# Altium project ZYNQ7020.PrjPcb (part 3 of 3)
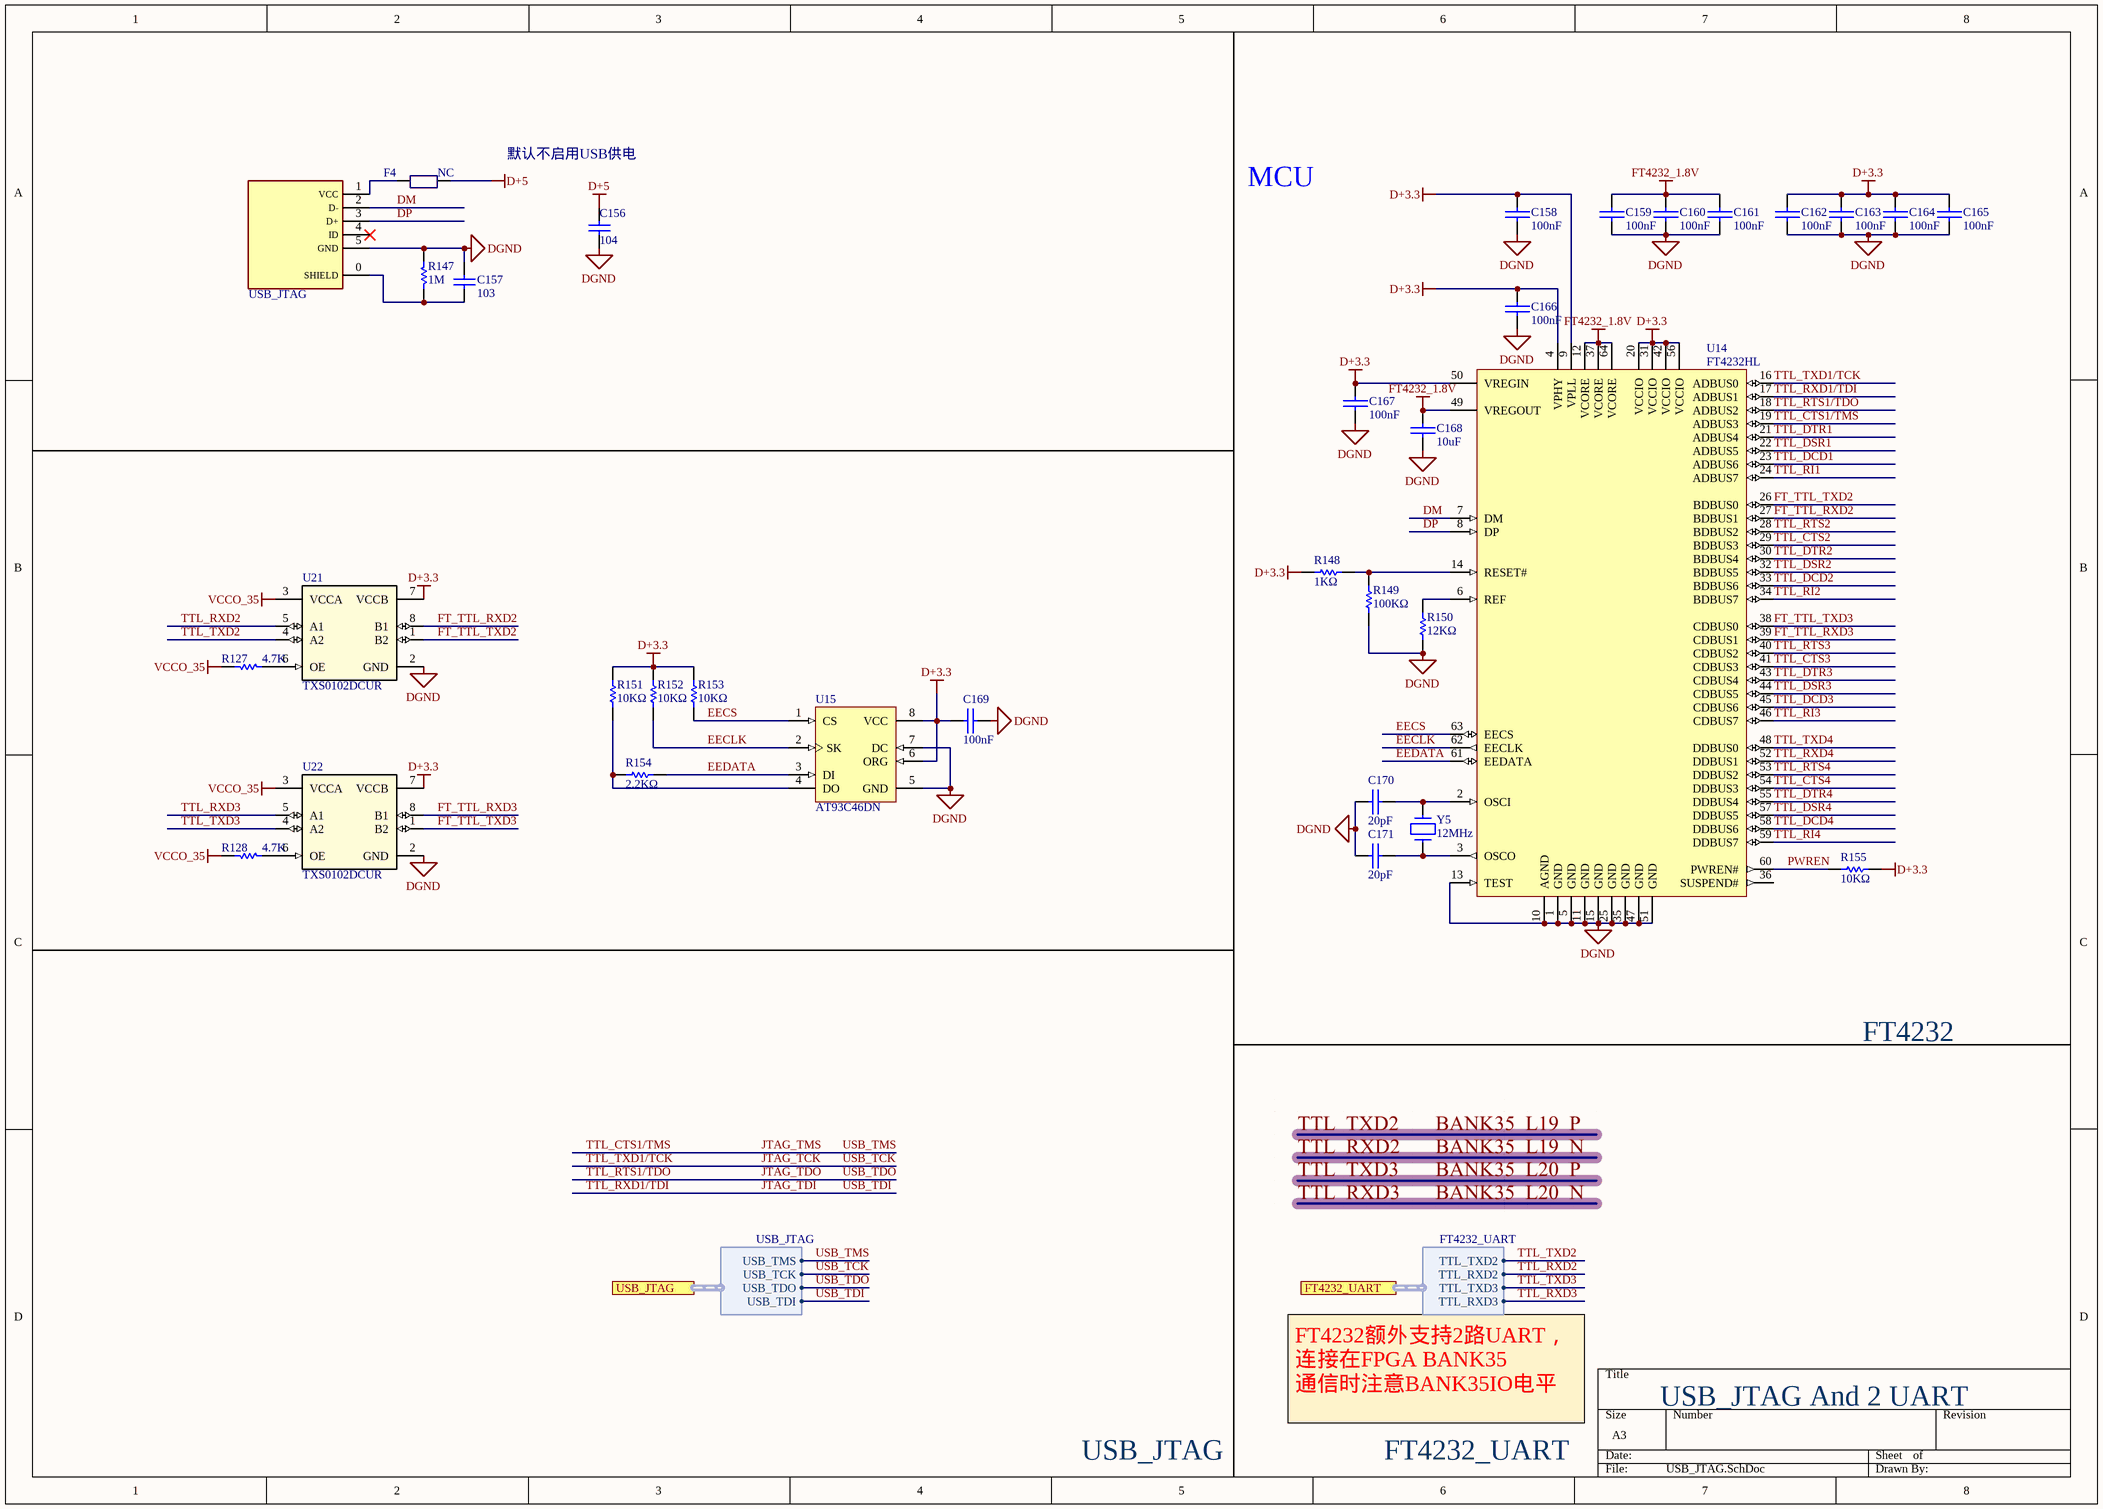
[diagram p16: USB_JTAG.SchDoc]

## Nets that join several sheets
D+1.0: ZYNQ_SOC_PWR (27 pins), PWR (R117.2), Ethernet (8 pins)
D+1.5: ZYNQ_SOC_ARM (R11.2 R13.2), ZYNQ_SOC_PWR (17 pins), DDR (70 pins), PWR (R37.1 R119.2 U18.2)
D+1.8: ZYNQ_SOC_PWR (FB2.1), PWR (R118.2), Ethernet (10 pins), USB (9 pins)
D+1.8_AUX: ZYNQ_SOC_ARM (R7.2 R8.2), ZYNQ_SOC_PWR (29 pins), UART (C195.2 R126.2 U20.3), SD_Card (C95.1 R124.1 U19.5)
D+3.3: ZYNQ_SOC_ARM (7 pins), ZYNQ_SOC_FPGA (C5.1 Y2.1 Y2.4), ZYNQ_SOC_JTAG (8 pins), ZYNQ_SOC_PWR (FB3.1), EX_IO (6 pins), FLASH (C46.2 R89.2 U5.8), Human_Interface (12 pins), UART (U20.7), SD_Card (5 pins), PWR (5 pins), Ethernet (14 pins), USB (5 pins), USB_JTAG (24 pins)
D+3.3_PS: ZYNQ_SOC_FPGA (R14.2), ZYNQ_SOC_JTAG (R17.2 R23.2 R24.2 U2.M6), ZYNQ_SOC_PWR (24 pins)
D+5: EX_IO (C44.1 C45.1 R157.2 R158.2), UART (R130.2), PWR (R122.2 R156.2), USB (FB4.1), USB_JTAG (C156.2 F4.1)
DDR_RVTT: DDR (41 pins), PWR (U18.3 U18.5)
DGND: ZYNQ_SOC_ARM (12 pins), ZYNQ_SOC_FPGA (C5.2 R15.1 Y2.2), ZYNQ_SOC_JTAG (19 pins), ZYNQ_SOC_PWR (102 pins), EX_IO (10 pins), FLASH (C46.1 U5.4), DDR (96 pins), Human_Interface (12 pins), UART (9 pins), SD_Card (9 pins), PWR (69 pins), Ethernet (35 pins), USB (28 pins), USB_JTAG (34 pins)
VCCO_35: ZYNQ_SOC_PWR (10 pins), USB_JTAG (R127.2 R128.2 U21.3 U22.3)
VTT_REF: DDR (U3.H1 U3.M8 U17.H1 U17.M8), PWR (C7.2 C190.2 U18.6)
BANK34_0: ZYNQ_SOC_FPGA (U2.R19), Human_Interface (R98.1)
BANK34_25: ZYNQ_SOC_FPGA (U2.T19), Human_Interface (R96.1)
BANK34_L1_N: ZYNQ_SOC_FPGA (U2.T10), EX_IO (RP18.2)
BANK34_L1_P: ZYNQ_SOC_FPGA (U2.T11), EX_IO (RP18.1)
BANK34_L2_N: ZYNQ_SOC_FPGA (U2.U12), EX_IO (RP16.3)
BANK34_L2_P: ZYNQ_SOC_FPGA (U2.T12), EX_IO (RP16.4)
BANK34_L4_N: ZYNQ_SOC_FPGA (U2.W13), EX_IO (RP14.3)
BANK34_L4_P: ZYNQ_SOC_FPGA (U2.V12), EX_IO (RP14.4)
BANK34_L5_N: ZYNQ_SOC_FPGA (U2.T15), EX_IO (RP14.1)
BANK34_L5_P: ZYNQ_SOC_FPGA (U2.T14), EX_IO (RP14.2)
BANK34_L6_N: ZYNQ_SOC_FPGA (U2.R14), EX_IO (RP12.2)
BANK34_L6_P: ZYNQ_SOC_FPGA (U2.P14), EX_IO (RP12.1)
BANK34_L7_N: ZYNQ_SOC_FPGA (U2.Y17), EX_IO (RP8.1)
BANK34_L7_P: ZYNQ_SOC_FPGA (U2.Y16), EX_IO (RP8.2)
BANK34_L8_N: ZYNQ_SOC_FPGA (U2.Y14), EX_IO (RP10.3)
BANK34_L8_P: ZYNQ_SOC_FPGA (U2.W14), EX_IO (RP10.4)
BANK34_L9_N: ZYNQ_SOC_FPGA (U2.U17), EX_IO (RP6.3)
BANK34_L9_P: ZYNQ_SOC_FPGA (U2.T16), EX_IO (RP6.4)
BANK34_L10_N: ZYNQ_SOC_FPGA (U2.W15), EX_IO (RP10.2)
BANK34_L10_P: ZYNQ_SOC_FPGA (U2.V15), EX_IO (RP10.1)
BANK34_L11_N: ZYNQ_SOC_FPGA (U2.U15), EX_IO (RP12.3)
BANK34_L11_P: ZYNQ_SOC_FPGA (U2.U14), EX_IO (RP12.4)
BANK34_L12_N: ZYNQ_SOC_FPGA (U2.U19), Human_Interface (R94.1)
BANK34_L13_N: ZYNQ_SOC_FPGA (U2.P19), EX_IO (RP2.4)
BANK34_L13_P: ZYNQ_SOC_FPGA (U2.N18), EX_IO (RP2.3)
BANK34_L14_N: ZYNQ_SOC_FPGA (U2.P20), EX_IO (RP2.2)
BANK34_L14_P: ZYNQ_SOC_FPGA (U2.N20), EX_IO (RP2.1)
BANK34_L15_N: ZYNQ_SOC_FPGA (U2.U20), EX_IO (RP4.2)
BANK34_L15_P: ZYNQ_SOC_FPGA (U2.T20), EX_IO (RP4.1)
BANK34_L16_N: ZYNQ_SOC_FPGA (U2.W20), EX_IO (RP4.4)
BANK34_L16_P: ZYNQ_SOC_FPGA (U2.V20), EX_IO (RP4.3)
BANK34_L17_N: ZYNQ_SOC_FPGA (U2.Y19), EX_IO (RP6.1)
BANK34_L17_P: ZYNQ_SOC_FPGA (U2.Y18), EX_IO (RP6.2)
BANK34_L18_N: ZYNQ_SOC_FPGA (U2.W16), EX_IO (RP8.4)
BANK34_L18_P: ZYNQ_SOC_FPGA (U2.V16), EX_IO (RP8.3)
BANK34_L21_N: ZYNQ_SOC_FPGA (U2.V18), Human_Interface (C50.2 PL_K2.1 R97.1)
BANK34_L21_P: ZYNQ_SOC_FPGA (U2.V17), Human_Interface (C49.2 PL_K1.1 R95.1)
BANK34_L22_N: ZYNQ_SOC_FPGA (U2.W19), Human_Interface (C52.2 PL_K4.1 R101.1)
BANK34_L22_P: ZYNQ_SOC_FPGA (U2.W18), Human_Interface (C51.2 PL_K3.1 R99.1)
BANK34_L23_N: ZYNQ_SOC_FPGA (U2.P18), Human_Interface (R100.1)
BANK34_L24_N: ZYNQ_SOC_FPGA (U2.P16), EX_IO (RP16.2)
BANK34_L24_P: ZYNQ_SOC_FPGA (U2.P15), EX_IO (RP16.1)
BANK35_L1_N: ZYNQ_SOC_FPGA (U2.B20), EX_IO (RP3.3)
BANK35_L1_P: ZYNQ_SOC_FPGA (U2.C20), EX_IO (RP3.4)
BANK35_L2_N: ZYNQ_SOC_FPGA (U2.A20), EX_IO (RP3.1)
BANK35_L2_P: ZYNQ_SOC_FPGA (U2.B19), EX_IO (RP3.2)
BANK35_L3_N: ZYNQ_SOC_FPGA (U2.D18), EX_IO (RP7.1)
BANK35_L3_P: ZYNQ_SOC_FPGA (U2.E17), EX_IO (RP7.2)
BANK35_L4_N: ZYNQ_SOC_FPGA (U2.D20), EX_IO (RP5.2)
BANK35_L4_P: ZYNQ_SOC_FPGA (U2.D19), EX_IO (RP5.1)
BANK35_L5_N: ZYNQ_SOC_FPGA (U2.E19), EX_IO (RP5.4)
BANK35_L5_P: ZYNQ_SOC_FPGA (U2.E18), EX_IO (RP5.3)
BANK35_L6_N: ZYNQ_SOC_FPGA (U2.F17), EX_IO (RP7.3)
BANK35_L6_P: ZYNQ_SOC_FPGA (U2.F16), EX_IO (RP7.4)
BANK35_L7_N: ZYNQ_SOC_FPGA (U2.M20), EX_IO (RP17.3)
BANK35_L7_P: ZYNQ_SOC_FPGA (U2.M19), EX_IO (RP17.4)
BANK35_L8_N: ZYNQ_SOC_FPGA (U2.M18), EX_IO (RP19.1)
BANK35_L8_P: ZYNQ_SOC_FPGA (U2.M17), EX_IO (RP19.2)
BANK35_L9_N: ZYNQ_SOC_FPGA (U2.L20), EX_IO (RP15.3)
BANK35_L9_P: ZYNQ_SOC_FPGA (U2.L19), EX_IO (RP15.4)
BANK35_L10_N: ZYNQ_SOC_FPGA (U2.J19), EX_IO (RP13.3)
BANK35_L10_P: ZYNQ_SOC_FPGA (U2.K19), EX_IO (RP13.4)
BANK35_L11_N: ZYNQ_SOC_FPGA (U2.L17), EX_IO (RP17.1)
BANK35_L11_P: ZYNQ_SOC_FPGA (U2.L16), EX_IO (RP17.2)
BANK35_L12_N: ZYNQ_SOC_FPGA (U2.K18), EX_IO (RP15.2)
BANK35_L12_P: ZYNQ_SOC_FPGA (U2.K17), EX_IO (RP15.1)
BANK35_L13_N: ZYNQ_SOC_FPGA (U2.H17), EX_IO (RP11.2)
BANK35_L13_P: ZYNQ_SOC_FPGA (U2.H16), EX_IO (RP11.1)
BANK35_L14_N: ZYNQ_SOC_FPGA (U2.H18), EX_IO (RP11.3)
BANK35_L14_P: ZYNQ_SOC_FPGA (U2.J18), EX_IO (RP11.4)
BANK35_L15_N: ZYNQ_SOC_FPGA (U2.F20), EX_IO (RP9.2)
BANK35_L15_P: ZYNQ_SOC_FPGA (U2.F19), EX_IO (RP9.1)
BANK35_L16_N: ZYNQ_SOC_FPGA (U2.G18), EX_IO (RP9.4)
BANK35_L16_P: ZYNQ_SOC_FPGA (U2.G17), EX_IO (RP9.3)
BANK35_L17_N: ZYNQ_SOC_FPGA (U2.H20), EX_IO (RP13.1)
BANK35_L17_P: ZYNQ_SOC_FPGA (U2.J20), EX_IO (RP13.2)
BANK35_L19_N: ZYNQ_SOC_FPGA (U2.G15), USB_JTAG (U21.5)
BANK35_L19_P: ZYNQ_SOC_FPGA (U2.H15), USB_JTAG (U21.4)
BANK35_L20_N: ZYNQ_SOC_FPGA (U2.J14), USB_JTAG (U22.5)
BANK35_L20_P: ZYNQ_SOC_FPGA (U2.K14), USB_JTAG (U22.4)
BANK35_L22_N: ZYNQ_SOC_FPGA (U2.L15), EX_IO (RP19.3)
BANK35_L22_P: ZYNQ_SOC_FPGA (U2.L14), EX_IO (RP19.4)
BANK35_L23_N: ZYNQ_SOC_FPGA (U2.M15), EX_IO (RP22.1)
BANK35_L23_P: ZYNQ_SOC_FPGA (U2.M14), EX_IO (RP22.2)
DDR_A0: ZYNQ_SOC_ARM (U2.N2), DDR (R54.1 U3.N3 U17.N3)
DDR_A1: ZYNQ_SOC_ARM (U2.K2), DDR (R53.1 U3.P7 U17.P7)
DDR_A2: ZYNQ_SOC_ARM (U2.M3), DDR (R52.1 U3.P3 U17.P3)
DDR_A3: ZYNQ_SOC_ARM (U2.K3), DDR (R51.1 U3.N2 U17.N2)
DDR_A4: ZYNQ_SOC_ARM (U2.M4), DDR (R50.1 U3.P8 U17.P8)
DDR_A5: ZYNQ_SOC_ARM (U2.L1), DDR (R49.1 U3.P2 U17.P2)
DDR_A6: ZYNQ_SOC_ARM (U2.L4), DDR (R48.1 U3.R8 U17.R8)
DDR_A7: ZYNQ_SOC_ARM (U2.K4), DDR (R47.1 U3.R2 U17.R2)
DDR_A8: ZYNQ_SOC_ARM (U2.K1), DDR (R46.1 U3.T8 U17.T8)
DDR_A9: ZYNQ_SOC_ARM (U2.J4), DDR (R45.1 U3.R3 U17.R3)
DDR_A10: ZYNQ_SOC_ARM (U2.F5), DDR (R44.1 U3.L7 U17.L7)
DDR_A11: ZYNQ_SOC_ARM (U2.G4), DDR (R43.1 U3.R7 U17.R7)
DDR_A12: ZYNQ_SOC_ARM (U2.E4), DDR (R42.1 U3.N7 U17.N7)
DDR_A13: ZYNQ_SOC_ARM (U2.D4), DDR (R41.1 U3.T3 U17.T3)
DDR_A14: ZYNQ_SOC_ARM (U2.F4), DDR (R40.1 U3.T7 U17.T7)
DDR_BA0: ZYNQ_SOC_ARM (U2.L5), DDR (R56.1 U3.M2 U17.M2)
DDR_BA1: ZYNQ_SOC_ARM (U2.R4), DDR (R57.1 U3.N8 U17.N8)
DDR_BA2: ZYNQ_SOC_ARM (U2.J5), DDR (R58.1 U3.M3 U17.M3)
DDR_CAS: ZYNQ_SOC_ARM (U2.P5), DDR (R159.1 U3.K3 U17.K3)
DDR_CK_N: ZYNQ_SOC_ARM (U2.M2), DDR (R162.2 U3.K7 U17.K7)
DDR_CK_P: ZYNQ_SOC_ARM (U2.L2), DDR (R162.1 U3.J7 U17.J7)
DDR_CKE: ZYNQ_SOC_ARM (U2.N3), DDR (R59.1 U3.K9 U17.K9)
DDR_CS: ZYNQ_SOC_ARM (U2.N1), DDR (R60.1 U3.L2 U17.L2)
DDR_DATA_Byte0.DDR_DM0: ZYNQ_SOC_ARM (U2.A1), DDR (U3.E7)
DDR_DATA_Byte0.DDR_DQ0: ZYNQ_SOC_ARM (U2.C3), DDR (U3.E3)
DDR_DATA_Byte0.DDR_DQ1: ZYNQ_SOC_ARM (U2.B3), DDR (U3.F7)
DDR_DATA_Byte0.DDR_DQ2: ZYNQ_SOC_ARM (U2.A2), DDR (U3.F2)
DDR_DATA_Byte0.DDR_DQ3: ZYNQ_SOC_ARM (U2.A4), DDR (U3.F8)
DDR_DATA_Byte0.DDR_DQ4: ZYNQ_SOC_ARM (U2.D3), DDR (U3.H3)
DDR_DATA_Byte0.DDR_DQ5: ZYNQ_SOC_ARM (U2.D1), DDR (U3.H8)
DDR_DATA_Byte0.DDR_DQ6: ZYNQ_SOC_ARM (U2.C1), DDR (U3.G2)
DDR_DATA_Byte0.DDR_DQ7: ZYNQ_SOC_ARM (U2.E1), DDR (U3.H7)
DDR_DATA_Byte0.DDR_DQS0_N: ZYNQ_SOC_ARM (U2.B2), DDR (U3.G3)
DDR_DATA_Byte0.DDR_DQS0_P: ZYNQ_SOC_ARM (U2.C2), DDR (U3.F3)
DDR_DATA_Byte1.DDR_DM1: ZYNQ_SOC_ARM (U2.F1), DDR (U3.D3)
DDR_DATA_Byte1.DDR_DQ8: ZYNQ_SOC_ARM (U2.E2), DDR (U3.D7)
DDR_DATA_Byte1.DDR_DQ9: ZYNQ_SOC_ARM (U2.E3), DDR (U3.C3)
DDR_DATA_Byte1.DDR_DQ10: ZYNQ_SOC_ARM (U2.G3), DDR (U3.C8)
DDR_DATA_Byte1.DDR_DQ11: ZYNQ_SOC_ARM (U2.H3), DDR (U3.C2)
DDR_DATA_Byte1.DDR_DQ12: ZYNQ_SOC_ARM (U2.J3), DDR (U3.A7)
DDR_DATA_Byte1.DDR_DQ13: ZYNQ_SOC_ARM (U2.H2), DDR (U3.A2)
DDR_DATA_Byte1.DDR_DQ14: ZYNQ_SOC_ARM (U2.H1), DDR (U3.B8)
DDR_DATA_Byte1.DDR_DQ15: ZYNQ_SOC_ARM (U2.J1), DDR (U3.A3)
DDR_DATA_Byte1.DDR_DQS1_N: ZYNQ_SOC_ARM (U2.F2), DDR (U3.B7)
DDR_DATA_Byte1.DDR_DQS1_P: ZYNQ_SOC_ARM (U2.G2), DDR (U3.C7)
DDR_DATA_Byte2.DDR_DM2: ZYNQ_SOC_ARM (U2.T1), DDR (U17.E7)
DDR_DATA_Byte2.DDR_DQ16: ZYNQ_SOC_ARM (U2.P1), DDR (U17.E3)
DDR_DATA_Byte2.DDR_DQ17: ZYNQ_SOC_ARM (U2.P3), DDR (U17.F7)
DDR_DATA_Byte2.DDR_DQ18: ZYNQ_SOC_ARM (U2.R3), DDR (U17.F2)
DDR_DATA_Byte2.DDR_DQ19: ZYNQ_SOC_ARM (U2.R1), DDR (U17.F8)
DDR_DATA_Byte2.DDR_DQ20: ZYNQ_SOC_ARM (U2.T4), DDR (U17.H3)
DDR_DATA_Byte2.DDR_DQ21: ZYNQ_SOC_ARM (U2.U4), DDR (U17.H8)
DDR_DATA_Byte2.DDR_DQ22: ZYNQ_SOC_ARM (U2.U2), DDR (U17.G2)
DDR_DATA_Byte2.DDR_DQ23: ZYNQ_SOC_ARM (U2.U3), DDR (U17.H7)
DDR_DATA_Byte2.DDR_DQS2_N: ZYNQ_SOC_ARM (U2.T2), DDR (U17.G3)
DDR_DATA_Byte2.DDR_DQS2_P: ZYNQ_SOC_ARM (U2.R2), DDR (U17.F3)
DDR_DATA_Byte3.DDR_DM3: ZYNQ_SOC_ARM (U2.Y1), DDR (U17.D3)
DDR_DATA_Byte3.DDR_DQ24: ZYNQ_SOC_ARM (U2.V1), DDR (U17.D7)
DDR_DATA_Byte3.DDR_DQ25: ZYNQ_SOC_ARM (U2.Y3), DDR (U17.C3)
DDR_DATA_Byte3.DDR_DQ26: ZYNQ_SOC_ARM (U2.W1), DDR (U17.C8)
DDR_DATA_Byte3.DDR_DQ27: ZYNQ_SOC_ARM (U2.Y4), DDR (U17.C2)
DDR_DATA_Byte3.DDR_DQ28: ZYNQ_SOC_ARM (U2.Y2), DDR (U17.A7)
DDR_DATA_Byte3.DDR_DQ29: ZYNQ_SOC_ARM (U2.W3), DDR (U17.A2)
DDR_DATA_Byte3.DDR_DQ30: ZYNQ_SOC_ARM (U2.V2), DDR (U17.B8)
DDR_DATA_Byte3.DDR_DQ31: ZYNQ_SOC_ARM (U2.V3), DDR (U17.A3)
DDR_DATA_Byte3.DDR_DQS3_N: ZYNQ_SOC_ARM (U2.W4), DDR (U17.B7)
DDR_DATA_Byte3.DDR_DQS3_P: ZYNQ_SOC_ARM (U2.W5), DDR (U17.C7)
DDR_ODT: ZYNQ_SOC_ARM (U2.N5), DDR (R55.2 U3.K1 U17.K1)
DDR_RAS: ZYNQ_SOC_ARM (U2.P4), DDR (R63.1 U3.J3 U17.J3)
DDR_RESET: ZYNQ_SOC_ARM (U2.B4), DDR (R61.2 U3.T2 U17.T2)
DDR_WE: ZYNQ_SOC_ARM (U2.M5), DDR (R160.1 U3.L3 U17.L3)
JTAG_TCK: ZYNQ_SOC_JTAG (P1.6 R20.1 RP1.7), USB_JTAG (U14.16)
JTAG_TDI: ZYNQ_SOC_JTAG (P1.10 R18.1 RP1.5), USB_JTAG (U14.17)
JTAG_TDO: ZYNQ_SOC_JTAG (P1.8 R19.1 RP1.6), USB_JTAG (U14.18)
JTAG_TMS: ZYNQ_SOC_JTAG (P1.4 R21.1 RP1.8), USB_JTAG (U14.19)
OTG_CLK: ZYNQ_SOC_ARM (U2.A11), USB (R143.1)
OTG_DATA0: ZYNQ_SOC_ARM (U2.A14), USB (U12.3)
OTG_DATA1: ZYNQ_SOC_ARM (U2.D15), USB (U12.4)
OTG_DATA2: ZYNQ_SOC_ARM (U2.A12), USB (U12.5)
OTG_DATA3: ZYNQ_SOC_ARM (U2.F12), USB (U12.6)
OTG_DATA4: ZYNQ_SOC_ARM (U2.C16), USB (U12.7)
OTG_DATA5: ZYNQ_SOC_ARM (U2.A10), USB (U12.9)
OTG_DATA6: ZYNQ_SOC_ARM (U2.E13), USB (U12.10)
OTG_DATA7: ZYNQ_SOC_ARM (U2.C18), USB (U12.13)
OTG_DIR: ZYNQ_SOC_ARM (U2.C13), USB (U12.31)
OTG_NXT: ZYNQ_SOC_ARM (U2.E16), USB (U12.2)
OTG_RESETN: ZYNQ_SOC_ARM (U2.D16), USB (C142.1 R141.1 U12.27)
OTG_STP: ZYNQ_SOC_ARM (U2.C15), USB (U12.29)
PS_KEY1: ZYNQ_SOC_ARM (U2.B13), Human_Interface (C47.2 PS_K1.1 R91.1)
PS_KEY2: ZYNQ_SOC_ARM (U2.B9), Human_Interface (C48.2 PS_K2.1 R93.1)
PS_LED1: ZYNQ_SOC_ARM (U2.E6), Human_Interface (R90.1)
PS_LED2: ZYNQ_SOC_ARM (U2.E8), Human_Interface (R92.1)
PS_MIO7: ZYNQ_SOC_ARM (U2.D8), ZYNQ_SOC_JTAG (R31.2), EX_IO (RP20.1)
PS_MIO8: ZYNQ_SOC_ARM (U2.D5), ZYNQ_SOC_JTAG (R26.2 R27.2), EX_IO (RP20.2)
PS_MIO9: ZYNQ_SOC_ARM (U2.B5), EX_IO (RP20.3)
PS_MIO10: ZYNQ_SOC_ARM (U2.E9), EX_IO (RP20.4)
PS_MIO11: ZYNQ_SOC_ARM (U2.C6), EX_IO (RP21.1)
PS_MIO12: ZYNQ_SOC_ARM (U2.D9), EX_IO (RP21.2)
PS_MIO14: ZYNQ_SOC_ARM (U2.C5), EX_IO (RP21.3)
PS_MIO15: ZYNQ_SOC_ARM (U2.C8), EX_IO (RP21.4)
PS_RESET: ZYNQ_SOC_ARM (R1.1 R3.2 R4.2 U2.C7), Ethernet (U4.29)
QSPI_CS: ZYNQ_SOC_ARM (U2.A7), FLASH (R89.1 U5.1)
QSPI_CSK: ZYNQ_SOC_ARM (U2.A5), ZYNQ_SOC_JTAG (R30.2), FLASH (U5.6)
QSPI_D0: ZYNQ_SOC_ARM (U2.B8), ZYNQ_SOC_JTAG (R28.2), FLASH (U5.5)
QSPI_D1: ZYNQ_SOC_ARM (U2.D6), ZYNQ_SOC_JTAG (R29.2), FLASH (U5.2)
QSPI_D2: ZYNQ_SOC_ARM (U2.B7), ZYNQ_SOC_JTAG (R34.2), FLASH (U5.3)
QSPI_D3: ZYNQ_SOC_ARM (U2.A6), ZYNQ_SOC_JTAG (R33.2), FLASH (U5.7)
SDIO_CD: ZYNQ_SOC_ARM (U2.B14), SD_Card (R124.2 R125.1)
SDIO_CLK: ZYNQ_SOC_ARM (U2.D14), SD_Card (U19.9)
SDIO_CMD: ZYNQ_SOC_ARM (U2.C17), SD_Card (U19.4)
SDIO_D0: ZYNQ_SOC_ARM (U2.E12), SD_Card (U19.6)
SDIO_D1: ZYNQ_SOC_ARM (U2.A9), SD_Card (U19.7)
SDIO_D2: ZYNQ_SOC_ARM (U2.F13), SD_Card (U19.1)
SDIO_D3: ZYNQ_SOC_ARM (U2.B15), SD_Card (U19.3)
TCP_MDC: ZYNQ_SOC_ARM (U2.C10), Ethernet (U4.30)
TCP_MDIO: ZYNQ_SOC_ARM (U2.C11), Ethernet (R68.1 U4.31)
TCP_RXC: ZYNQ_SOC_ARM (U2.B17), Ethernet (U4.19)
TCP_RXCTL: ZYNQ_SOC_ARM (U2.D13), Ethernet (R77.1 R78.2 U4.13)
TCP_RXD0: ZYNQ_SOC_ARM (U2.D11), Ethernet (R83.1 R84.2 U4.14)
TCP_RXD1: ZYNQ_SOC_ARM (U2.A16), Ethernet (R75.1 R76.2 U4.16)
TCP_RXD2: ZYNQ_SOC_ARM (U2.F15), Ethernet (R85.1 R86.2 U4.17)
TCP_RXD3: ZYNQ_SOC_ARM (U2.A15), Ethernet (R87.1 R88.2 U4.18)
TCP_TXC: ZYNQ_SOC_ARM (U2.A19), Ethernet (U4.22)
TCP_TXD0: ZYNQ_SOC_ARM (U2.E14), Ethernet (U4.23)
TCP_TXD1: ZYNQ_SOC_ARM (U2.B18), Ethernet (U4.24)
TCP_TXD2: ZYNQ_SOC_ARM (U2.D10), Ethernet (U4.25)
TCP_TXD3: ZYNQ_SOC_ARM (U2.A17), Ethernet (U4.26)
TCP_TXTCL: ZYNQ_SOC_ARM (U2.F14), Ethernet (U4.27)
UART_RXD: ZYNQ_SOC_ARM (U2.C12), UART (U20.5)
UART_TXD: ZYNQ_SOC_ARM (U2.B12), UART (U20.4)